# Altium project ST1-1.PrjPcb (part 5 of 5)

## Sheet HV_Detection.SchDoc: Output Terminals & Voltage detection
size A3; DocumentNumber: 9; SheetNumber: 12; SheetTotal: 20
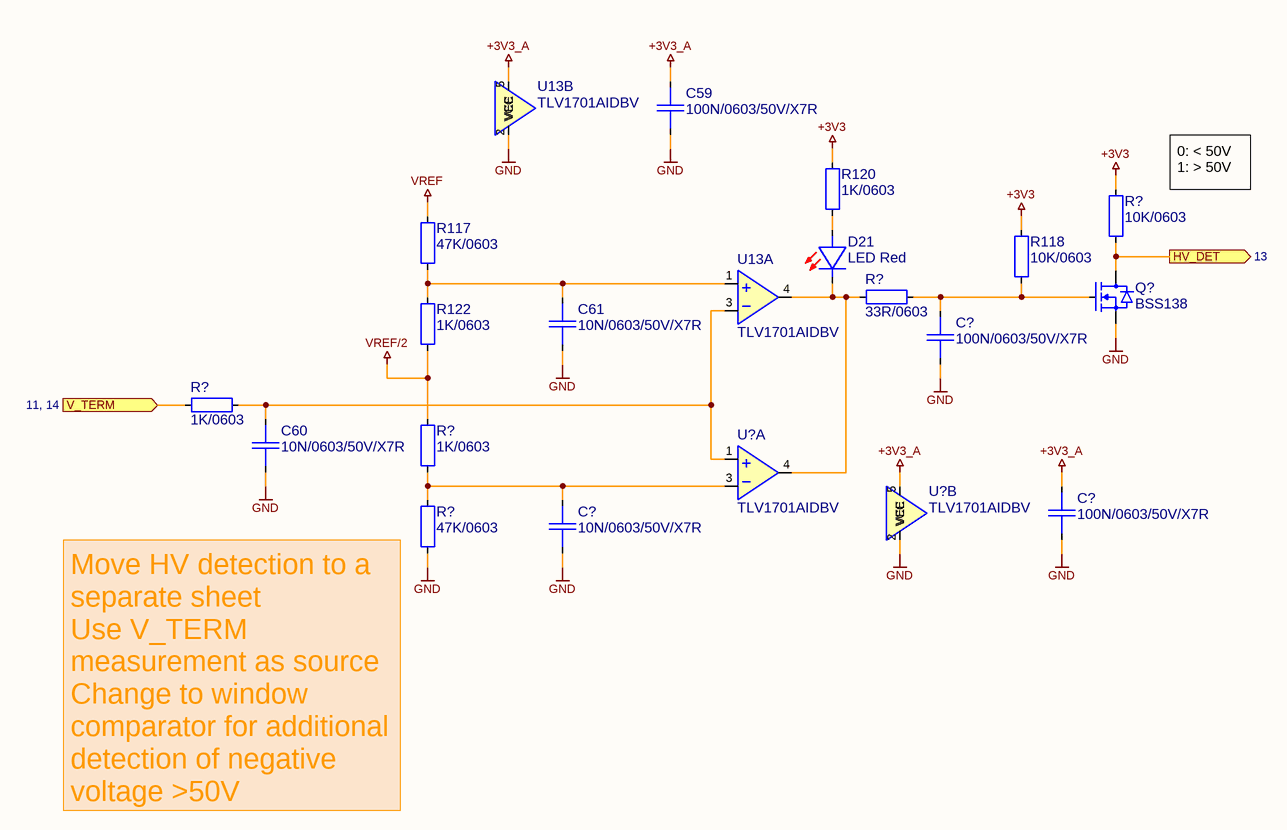
[diagram p12: HV_Detection.SchDoc]

### Parts
(Parts that share a designator on the sheet are numbered #1, #2 ... from top to bottom, then left to right.)
C59  100N/0603/50V/X7R  [CAP0603_X7R]
C60  10N/0603/50V/X7R  [CAP0603_X7R]
C61  10N/0603/50V/X7R  [CAP0603_X7R]
C?#3  100N/0603/50V/X7R  [CAP0603_X7R]
C?#4  100N/0603/50V/X7R  [CAP0603_X7R]
C?#5  10N/0603/50V/X7R  [CAP0603_X7R]
D21  LED Red  [LED0805_RED]
Q?#2  BSS138  [SOT2395P280X125-3-SE]
R117  47K/0603  [R0603-0.40-WW]
R118  10K/0603  [R0603-0.40-WW]
R120  1K/0603  [R0603-0.40-WW]
R122  1K/0603  [R0603-0.40-WW]
R?#32  10K/0603  [R0603-0.40-WW]
R?#33  33R/0603  [R0603-0.40-WW]
R?#34  1K/0603  [R0603-0.40-WW]
R?#35  1K/0603  [R0603-0.40-WW]
R?#36  47K/0603  [R0603-0.40-WW]
U13  TLV1701AIDBV  [SOT2395P280X125-5-NW]  (parts A,B of 2)
U?#3  TLV1701AIDBV  [SOT2395P280X125-5-NW]  (part A of 2)
U?#4  TLV1701AIDBV  [SOT2395P280X125-5-NW]  (part B of 2)

### Ports
HV_DET (out, see 13), V_TERM (in, see 11, 14)

### Nets
+3V3: R118.1 R120.2 R?#32.1
+3V3_A: C59.1 C?#4.1 U13.5(VCC) U?#4.5(VCC)
GND: C59.2 C60.2 C61.2 C?#3.2 C?#4.2 C?#5.2 Q?#2.2(SOURCE) R?#36.2 U13.2(VEE) U?#4.2(VEE)
VREF: R117.1
VREF/2: R122.2 R?#35.1
HV_DET: Q?#2.3(DRAIN) R?#32.2 ; port HV_DET
V_TERM: R?#34.1 ; port V_TERM
NetC60_1: C60.1 R?#34.2 U13.3(IN-) U?#3.1(IN+)
NetC61_1: C61.1 R117.2 R122.1 U13.1(IN+)
NetC?#3_1: C?#3.1 Q?#2.1(GATE) R118.2 R?#33.2
NetC?#5_1: C?#5.1 R?#35.2 R?#36.1 U?#3.3(IN-)
NetD21_1: D21.1(C) R?#33.1 U13.4(OUT) U?#3.4(OUT)
NetD21_2: D21.2(A) R120.1

### Notes on the sheet
- 0: < 50V
  1: > 50V
- (near R?#36) Move HV detection to a separate sheet
  Use V_TERM measurement as source
  Change to window comparator for additional detection of negative voltage >50V
- Date:
- Size:
- A3
- Schema:
- Layout:

### Library data of the parts
C59 C?#3 C?#4 = 100N/0603/50V/X7R: CAP SM 0603 100nF 50V X7R; Manufacturer: GENERIC; Manufacturer 1: YAGEO; Manufacturer Part Number 1: CC0603KPX7R9BB104; Absolute Value: 1E-7; Eurocircuits GPN: GPC0603104; Part Number: 100N/0603/50V/X7R; Package: 0603; Value: 100nF; HelpURL: https://www.yageo.com/upload/media/product/app/datasheet/mlcc/upy-gphc_x7r_6_3v-to-250v.pdf; Supplier 1: Digi-Key; Supplier Part Number 1: 311-3567-1-ND; Supplier 3: LCSC; Supplier Part Number 3: C14663; Manufacturer 2: YAGEO; Manufacturer Part Number 2: CC0603MRX7R9BB104; Supplier 2: Digi-Key; Supplier Part Number 2: 311-4110-1-ND; JLC Type: Basic; Manufacturer Part Number 3: CC0603KRX7R9BB104
C60 C61 C?#5 = 10N/0603/50V/X7R: CAP SM 0603 10nF 50V X7R; Manufacturer: GENERIC; Manufacturer 1: YAGEO; Manufacturer Part Number 1: CC0603KPX7R9BB103; Absolute Value: 1E-8; Eurocircuits GPN: GPC0603103; Part Number: 10N/0603/50V/X7R; Package: 0603; Value: 10nF; HelpURL: https://www.yageo.com/upload/media/product/app/datasheet/mlcc/upy-gphc_x7r_6_3v-to-250v.pdf; Supplier 1: Digi-Key; Supplier Part Number 1: 311-1572-1-ND; Manufacturer 2: YAGEO; Manufacturer Part Number 2: CC0603KRX7R9BB103; Supplier 2: Digi-Key; Supplier Part Number 2: 311-1085-1-ND; Manufacturer Part Number 3: CC0603KRX7R9BB103; Supplier 3: LCSC; Supplier Part Number 3: C100042
D21 = LED Red 0805: Generic LED Red 0805; Manufacturer 1: Würth; Manufacturer Part Number 1: 150080RS75000; Part Number: LED Red 0805; Manufacturer: GENERIC; Package: 805; Value: Red; Absolute Value: Red; HelpURL: https://www.we-online.com/katalog/datasheet/150060RS75000.pdf; Supplier 1: Digikey; Supplier Part Number 1: 732-4984-1-ND; Manufacturer 3: Foshan NationStar Optoelectronics; Manufacturer Part Number 3: NCD0805R1; Supplier 3: LCSC; Supplier Part Number 3: C84256; JLC Type: Basic
Q?#2 = BSS138: N-Kanal 50 V 220mA (Ta) 350mW (Ta) Oberflächenmontage SOT-23; Manufacturer: GENERIC; Manufacturer 1: ANBON SEMICONDUCTOR (INT'L) LIMITED; Part Number: BSS138; Package: SOT23; HelpURL: https://mm.digikey.com/Volume0/opasdata/d220001/medias/docus/3037/BSS138.pdf; Manufacturer Part Number 1: BSS138; Supplier 1: Digi-Key; Supplier Part Number 1: 4530-BSS138CT-ND; Manufacturer 3: FOSAN; Manufacturer Part Number 3: BSS138; Supplier 3: LCSC; Supplier Part Number 3: C2926186; JLC Type: Extended; Manufacturer 2: FOSAN; Manufacturer Part Number 2: BSS138; Supplier 2: LCSC; Supplier Part Number 2: C2926186
R117 R?#36 = 47K/0603: RES SM 0603 47K; Manufacturer: GENERIC; Manufacturer 1: YAGEO; Manufacturer Part Number 1: RC0603FR-1347KL; Absolute Value: 47000; Eurocircuits GPN: GPR060347K; Part Number: 47K/0603; Package: 0603; Value: 47K; HelpURL: https://www.yageogroup.com/content/datasheet/asset/file/PYU-RC_GROUP_51_ROHS_L; Supplier 1: Digi-Key; Supplier Part Number 1: 13-RC0603FR-1347KLCT-ND; Manufacturer 2: YAGEO; Manufacturer Part Number 2: RC0603FR-1047KL; Supplier 2: Digi-Key; Supplier Part Number 2: 13-RC0603FR-1047KLCT-ND; Manufacturer 3: UNI-ROYAL(Uniroyal Elec); Manufacturer Part Number 3: 0603WAF4702T5E; Supplier 3: LCSC; Supplier Part Number 3: C25819; JLC Type: Basic
R118 R?#32 = 10K/0603: RES SM 0603 10K; Manufacturer: GENERIC; Manufacturer 1: YAGEO; Manufacturer Part Number 1: RC0603FR-1310KL; Absolute Value: 10000; Eurocircuits GPN: GPR060310K; Part Number: 10K/0603; Package: 0603; Value: 10K; HelpURL: https://www.yageogroup.com/content/datasheet/asset/file/PYU-RC_GROUP_51_ROHS_L; Supplier 1: Digi-Key; Supplier Part Number 1: 13-RC0603FR-1310KLCT-ND; Manufacturer 2: YAGEO; Manufacturer Part Number 2: RC0603FR-1010KL; Supplier 2: Digi-Key; Supplier Part Number 2: 13-RC0603FR-1010KLCT-ND; Manufacturer 3: UNI-ROYAL(Uniroyal Elec); Manufacturer Part Number 3: 0603WAF1002T5E; Supplier 3: LCSC; Supplier Part Number 3: C25804; JLC Type: Basic
R120 R122 R?#34 R?#35 = 1K/0603: RES SM 0603 1K; Manufacturer: GENERIC; Manufacturer 1: YAGEO; Manufacturer Part Number 1: RC0603FR-131KL; Absolute Value: 1000; Eurocircuits GPN: GPR06031K; Part Number: 1K/0603; Package: 0603; Value: 1K; HelpURL: https://www.yageogroup.com/content/datasheet/asset/file/PYU-RC_GROUP_51_ROHS_L; Supplier 1: Digi-Key; Supplier Part Number 1: 13-RC0603FR-131KLCT-ND; Manufacturer 2: YAGEO; Manufacturer Part Number 2: RC0603FR-101KL; Supplier 2: Digi-Key; Supplier Part Number 2: 13-RC0603FR-101KLCT-ND; Manufacturer 3: UNI-ROYAL(Uniroyal Elec); Manufacturer Part Number 3: 0603WAF1001T5E; Supplier 3: LCSC; Supplier Part Number 3: C21190; JLC Type: Basic
R?#33 = 33R/0603: RES SM 0603 33R; Manufacturer: GENERIC; Manufacturer 1: YAGEO; Manufacturer Part Number 1: RC0603FR-1333RL; Absolute Value: 33; Eurocircuits GPN: GPR060333R; Part Number: 33R/0603; Package: 0603; Value: 33R; HelpURL: https://www.yageogroup.com/content/datasheet/asset/file/PYU-RC_GROUP_51_ROHS_L; Supplier 1: Digi-Key; Supplier Part Number 1: 13-RC0603FR-1333RLCT-ND; Manufacturer 2: YAGEO; Manufacturer Part Number 2: RC0603FR-1033RL; Supplier 2: Digi-Key; Supplier Part Number 2: 13-RC0603FR-1033RLCT-ND
U13 U?#3 U?#4 = TLV1701 SOT23: TLV1701 2.2-V to 36-V, microPower Comparato; Manufacturer: Texas Instruments; Manufacturer Part Number 1: TLV1701AIDBVR; Part Number: TLV1701 SOT23; Package: SOT23-5; HelpURL: https://www.ti.com/lit/ds/symlink/tlv1701.pdf; Manufacturer 1: Texas Instruments; Supplier 1: Digi-Key; Supplier Part Number 1: 296-40599-1-ND; Manufacturer 2: Texas Instruments; Manufacturer Part Number 2: TLV1701QDBVRQ1; Supplier 2: Digi-Key; Supplier Part Number 2: 296-47458-1-ND; Manufacturer 3: Texas Instruments; Manufacturer Part Number 3: TLV1701AIDBVR; Supplier 3: LCSC; Supplier Part Number 3: C130035

## Sheet Iso_Current_Limit.SchDoc: Current Limiter
size A3; DocumentNumber: 6; SheetNumber: 6; SheetTotal: 19
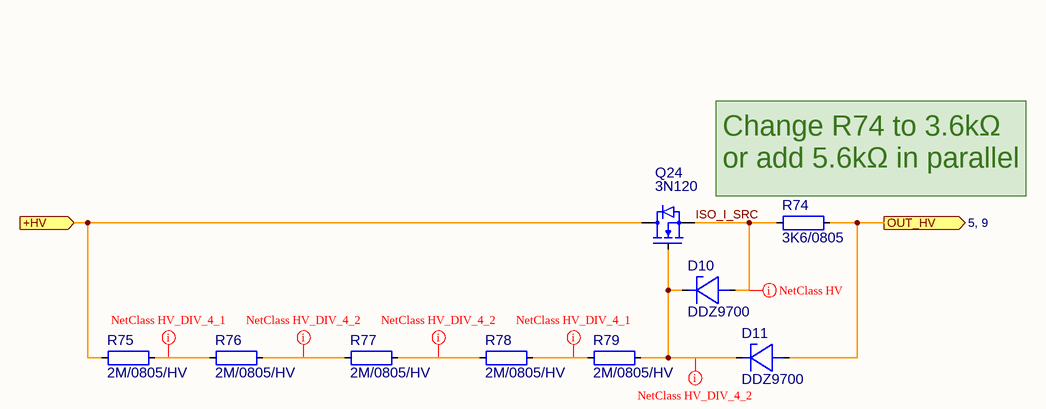
[diagram p13: Iso_Current_Limit.SchDoc]

### Parts
D10  DDZ9700  [SOD3718X125]
D11  DDZ9700  [SOD3718X125]
Q24  3N120  [TO228P990X229-3]
R74  3K6/0805  [R0805-0.50-WW]
R75  2M/0805/HV  [R0805-0.50-HV-WW]
R76  2M/0805/HV  [R0805-0.50-HV-WW]
R77  2M/0805/HV  [R0805-0.50-HV-WW]
R78  2M/0805/HV  [R0805-0.50-HV-WW]
R79  2M/0805/HV  [R0805-0.50-HV-WW]

### Ports
+HV (in), OUT_HV (out, see 5, 9)

### Nets
ISO_I_SRC: D10.2(A) Q24.2(SOURCE) R74.1
NetD10_1: D10.1(C) D11.1(C) Q24.1(GATE) R79.2
NetD11_2: D11.2(A) R74.2 ; port OUT_HV
NetQ24_3: Q24.3(DRAIN) R75.2 ; port +HV
NetR75_1: R75.1 R76.2
NetR76_1: R76.1 R77.2
NetR77_1: R77.1 R78.2
NetR78_1: R78.1 R79.1

### Layout directives
net class HV_DIV_4_1: NetR75_1, NetR78_1
net class HV_DIV_4_2: NetD10_1, NetR76_1, NetR77_1
net class HV: ISO_I_SRC

### Notes on the sheet
- TO-220 option: IXTP3N120
- (near Q24) Alternative:
  CMD3N120 (C49208270)
- Change R74 to 3.6kΩ
  or add 5.6kΩ in parallel
- Date:
- Size:
- A3
- Schema:
- Layout:

### Library data of the parts
D10 D11 = DDZ9700: Low current zener diode 13V 500mW SOD123; Manufacturer: Diodes Incorporated; Manufacturer Part Number 1: DDZ9700-7; Part Number: DDZ9700; Package: SOD-123; Value: 13V; Absolute Value: 13V; HelpURL: https://www.diodes.com/datasheet/download/DDZ96xx-DDZ97xx.pdf; Manufacturer 1: Diodes Incorporated; Supplier 1: Digikey; Supplier Part Number 1: 31-DDZ9700-7CT-ND; Manufacturer 3: DIODES; Manufacturer Part Number 3: DDZ9700-7; Supplier 3: LCSC; Supplier Part Number 3: C460862; JLC Type: Extended
Q24 = 3N120: N-Channel MOSFET 1200V; Manufacturer: Tech Public; Part Number: 3N120; Package: TO-252AA; HelpURL: https://www.lcsc.com/datasheet/C42437012.pdf; Manufacturer 3: TECH PUBLIC; Manufacturer Part Number 3: 3N120; Supplier 3: LCSC; Supplier Part Number 3: C42437012; JLC Type: Extended
R74 = 3K6/0805: RES SM 0805 3K6; Manufacturer: GENERIC; Manufacturer 1: YAGEO; Manufacturer Part Number 1: RC0805FR-133K6L; Absolute Value: 3600; Eurocircuits GPN: GPR08053K6; Part Number: 3K6/0805; Package: 0805; Value: 3K6; HelpURL: https://www.yageogroup.com/content/datasheet/asset/file/PYU-RC_GROUP_51_ROHS_L; Supplier 1: Digi-Key; Supplier Part Number 1: 13-RC0805FR-133K6LCT-ND; Manufacturer 2: YAGEO; Manufacturer Part Number 2: RC0805FR-073K6L; Supplier 2: Digi-Key; Supplier Part Number 2: 311-3.60KCRCT-ND
R75-R79 = 2M/0805/HV: RES SM 0805 2M High voltage; Manufacturer: GENERIC; Manufacturer 1: YAGEO; Manufacturer Part Number 1: RV0805FR-072ML; Absolute Value: 2000000; Part Number: 2M/0805/HV; Package: 0805; Value: 2M; HelpURL: https://www.yageogroup.com/content/datasheet/asset/file/PYU-RV_51_ROHS_L; Supplier 1: Digi-Key; Supplier Part Number 1: 13-RV0805FR-072MLCT-ND; JLC Type: Extended; Manufacturer 3: YAGEO; Manufacturer Part Number 3: RV0805FR-072ML; Supplier 3: LCSC; Supplier Part Number 3: C873372

## Nets that join several sheets
+3V3: ST1-1-Top (TP2.1), Microcontroller (11 pins), User_Interface (8 pins), Converter (C41.1 U6.14), Current_Controller (R149.1), Measurement (10 pins), Overvoltage_Protection (C54.1 D15.2 U9.5), Peripherals (17 pins), HV_Detection (R118.1 R120.2 R?#32.1)
+3V3_A: ST1-1-Top (TP10.1), Microcontroller (C102.1 U21.37), Battery_BMS (C13.1 U2.6), Converter (C?#1.1 U?#1.5), Current_Controller (Q32.2), Measurement (14 pins), Overvoltage_Protection (8 pins), Overcurrent_Protection (9 pins), HV_Detection (C59.1 C?#4.1 U13.5 U?#4.5)
+3V3_STBY: Microcontroller (D52.1), Battery_BMS (C6.1 U1.15), User_Interface (D34.2)
+5V: ST1-1-Top (TP4.1), Converter (C37.1 C38.1 U4.14 U5.14), Measurement (R?#12.2)
+15V: ST1-1-Top (TP1.1), User_Interface (R206.2), Converter (R57.1), Output_Terminals (7 pins), Current_Controller (7 pins), Measurement (R?#11.2)
GND: ST1-1-Top (TP6.1 TP7.1 TP8.1 TP9.1), Microcontroller (20 pins), Battery_BMS (8 pins), User_Interface (32 pins), Converter (22 pins), On_Off (15 pins), Output_Terminals (6 pins), Current_Controller (13 pins), Measurement (25 pins), Overvoltage_Protection (10 pins), Peripherals (31 pins), Overcurrent_Protection (7 pins), HV_Detection (10 pins)
GND_PWR: ST1-1-Top (TP5.1), Battery_BMS (NT1.2), Converter (22 pins), Output_Terminals (R129.2 R130.1), Overvoltage_Protection (C52.2 R89.2 R92.2 R94.2)
VBAT_STBY: Battery_BMS (Q1.3), On_Off (Q9.2 R30.1)
VREF: Converter (R51.1 R52.1 R53.1), Current_Controller (R131.1 R150.1), Peripherals (R236.1 U22.1 U22.4), HV_Detection (R117.1)
VREF/2: Battery_BMS (U2.5), Current_Controller (R146.2), Measurement (16 pins), Peripherals (U23.1 U23.4), HV_Detection (R122.2 R?#35.1)
ADC.CLK: Microcontroller (U21.73), Measurement (U18.17)
ADC.~{DRDY}: Microcontroller (U21.84), Measurement (U18.13)
ADC.~{SYNC}/~{RESET}: Microcontroller (U21.82), Measurement (U18.11)
BMS_CTRL.I_BAT: Microcontroller (U21.69), Battery_BMS (U2.1)
BMS_CTRL.WAKEUP: Microcontroller (U21.10), Battery_BMS (R21.2)
BMS_ON_OFF.CHG: Battery_BMS (U1.10), On_Off (Q17.1)
BMS_ON_OFF.DSG: Battery_BMS (Q2.1 R12.1 U1.9), User_Interface (Q36.1), On_Off (Q16.1)
BOOT0: Microcontroller (R233.1 U21.95), Peripherals (J7.9)
BUTTON.ESC: Microcontroller (U21.86), User_Interface (Q38.3 R223.2)
BUTTON.OK: Microcontroller (U21.98), User_Interface (Q37.3 R222.2)
BUTTON.OUT: Microcontroller (U21.96), User_Interface (Q39.3 R224.2)
CONV_CTRL.EN: Microcontroller (U21.38), Converter (R47.1 R50.1 U6.2 U6.5)
CONV_CTRL.PRIM_H: Microcontroller (U21.72), Converter (U6.10)
CONV_CTRL.PRIM_L: Microcontroller (U21.71), Converter (U6.13)
CONV_CTRL.SEC_H: Microcontroller (U21.68), Converter (U6.4)
CONV_CTRL.SEC_L: Microcontroller (U21.67), Converter (U6.1)
CONV_CTRL.TEMP_PRIM: Microcontroller (U21.56), Converter (C44.1 R53.2 R56.1)
CONV_CTRL.TEMP_SEC: Microcontroller (U21.57), Converter (C43.1 R52.2 R55.1)
CONV_CTRL.TEMP_TRAFO: Microcontroller (U21.59), Converter (C42.1 R51.2 R54.1)
DISCHARGE/: Microcontroller (U21.31), Converter (Q19.1 R58.1)
DISPLAY.CS: Microcontroller (U21.3), User_Interface (D40.1 R213.2)
DISPLAY.MISO: Microcontroller (U21.4), User_Interface (D37.1 R210.2)
DISPLAY.MOSI: Microcontroller (U21.5), User_Interface (D38.1 R211.2)
DISPLAY.SCK: Microcontroller (U21.1), User_Interface (D39.1 R212.2)
DISPLAY.WR: Microcontroller (U21.2), User_Interface (D41.1 R215.2)
ENCODER.A: Microcontroller (U21.94), User_Interface (C86.1 D45.1 R221.2)
ENCODER.B: Microcontroller (U21.93), User_Interface (C85.1 D44.1 R218.2)
HV_DET: User_Interface (R219.1), HV_Detection (Q?#2.3 R?#32.2)
I2C.ALERT: Microcontroller (U21.62), Battery_BMS (U1.14), Peripherals (R241.2 U26.13)
I2C.SCL: Microcontroller (U21.65), Battery_BMS (U1.12), User_Interface (D35.1 R207.1), Peripherals (R239.2 U25.6 U26.14)
I2C.SDA: Microcontroller (U21.66), Battery_BMS (U1.13), User_Interface (D36.1 R209.1), Peripherals (R240.2 U25.5 U26.15)
I_1A_REF: Microcontroller (U21.27), Current_Controller (R153.1)
I_ISO: Microcontroller (U21.70), Measurement (R198.2 U20.1), Overcurrent_Protection (U11.3)
I_ISO_N: Output_Terminals (C62.2 R127.2), Measurement (D33.3 U20.4)
I_ISO_P: Output_Terminals (C62.1 R125.2), Measurement (D32.3 U20.3)
I_OUT: Microcontroller (U21.20), Current_Controller (U14.5), Measurement (R175.2 U17.1)
I_OUT_N: Output_Terminals (C63.2 R130.2), Measurement (D29.3 U16.4)
I_OUT_P: Output_Terminals (C63.1 R128.2), Measurement (D28.3 U16.3)
NetK?#2_4: Output_Terminals (K?#2.4 R?#9.1), Current_Controller (Q31.3 R133.2 R137.2)
NetQ31_2: Output_Terminals (R126.2 R127.1 R128.1 R129.1), Current_Controller (Q31.2)
OCP/: Microcontroller (U21.30), Overcurrent_Protection (R100.1 R101.1 R104.2 U10.4)
ON_REQ: Microcontroller (U21.40), On_Off (Q15.1 R46.1)
OUT_HV: ST1-1-Top (TP13.1), Output_Terminals (K2.6 K2.8)
OUT_LV: ST1-1-Top (TP12.1), Converter (18 pins), Output_Terminals (K1.4 R107.2), Overvoltage_Protection (D13.1 D14.2)
OUT_SEL_HV: Microcontroller (U21.16), Output_Terminals (Q27.1 R114.1)
OUT_SEL_ISO: Microcontroller (U21.45), Output_Terminals (Q28.1 R124.1)
OVP/: Microcontroller (U21.18), Converter (D8.1), Overvoltage_Protection (5 pins)
OVP_RESET: Microcontroller (U21.17), Overvoltage_Protection (Q26.1 R83.1)
QSPI.CLK: Microcontroller (U21.25), Peripherals (U24.6)
QSPI.CS/: Microcontroller (U21.22), Peripherals (R?#31.2 U24.1)
QSPI.IO0: Microcontroller (U21.33), Peripherals (U24.5)
QSPI.IO1: Microcontroller (U21.32), Peripherals (U24.2)
QSPI.IO2: Microcontroller (U21.29), Peripherals (R?#29.2 U24.3)
QSPI.IO3: Microcontroller (U21.28), Peripherals (R?#30.2 U24.7)
RESET/: Microcontroller (R234.2 U21.14), Peripherals (J7.10 SW1.1)
SENS_N: Output_Terminals (J5.1), Measurement (R191.1 R?#21.1)
SENS_P: Output_Terminals (J4.1), Measurement (R178.1 R?#15.1)
SHUNT_EN: Microcontroller (U21.15), Current_Controller (Q33.1 R149.2)
SHUNT_ISO_EN: Microcontroller (U21.60), Current_Controller (Q30.1 R139.1)
SPI.CS: Microcontroller (U21.78), Measurement (U18.12)
SPI.MISO: Microcontroller (U21.80), Measurement (U18.15)
SPI.MOSI: Microcontroller (U21.81), Measurement (U18.16)
SPI.SCK: Microcontroller (U21.79), Measurement (U18.14)
SWD.SWCLK: Microcontroller (U21.77), Peripherals (J7.4)
SWD.SWDAT: Microcontroller (U21.76), Peripherals (J7.2)
SWD.SWO: Microcontroller (U21.90), Peripherals (J7.6)
TEMP_CURRENT: Microcontroller (U21.55), Current_Controller (C69.1 R150.2 R152.1)
TERM_N: Output_Terminals (GDT1.2 J3.1 K?#2.3), Measurement (R164.1)
TERM_P: Output_Terminals (F2.2 J2.1), Measurement (R154.1)
UART.RX: Microcontroller (U21.88), User_Interface (D43.1 R216.1), Peripherals (J7.7)
UART.TX: Microcontroller (U21.87), User_Interface (D42.1 R214.1), Peripherals (J7.8)
UI_ON_OFF.OFF: User_Interface (R228.2), On_Off (Q13.1)
UI_ON_OFF.ON: User_Interface (D46.1 D47.1 D48.1 R229.1), On_Off (Q14.1 R45.1)
UI_PRESENT: Microcontroller (U21.92), User_Interface (Q35.3 R205.1)
V_IN: Microcontroller (U21.44), On_Off (C15.1 R29.2 R34.1)
V_LV: Microcontroller (U21.46), Converter (U?#2.1 U?#2.4)
V_TERM: Microcontroller (U21.21), Measurement (R160.1 U15.6), HV_Detection (R?#34.1)
VBAT: Battery_BMS (8 pins), On_Off (11 pins)
VIN: ST1-1-Top (TP11.1), Converter (5 pins), On_Off (D6.1 Q6.1,2,3 R29.1 R31.1)
VREF/2_UC: Microcontroller (U21.26), Peripherals (R237.1)
VREF_UC: Microcontroller (U21.36), Peripherals (U22.3)

## Assembly variants
ST1-1: not fitted C95 C96 C128 C138 C145 D35 D36 L1 R48 R49 R107 R236 R238 Y2
ST1-10: not fitted C45 C46 C47 C48 C49 C50 C55 C56 C57 C62 C64 C65 C66 C67 C68 C69 C70 C78 C80 C81 C83 C84 C95 C96 C128 C138 C145 D9 D10 D11 D17 D18 D20 D22 D23 D24 D25 D30 D31 D32 D33 D35 D36 J4 J5 K1 K2 L1 L3 Q21 Q22 Q23 Q24 Q27 Q28 Q29 Q30 Q31 Q32 Q33 R48 R49 R60 R61 R62 R63 R64 R65 R66 R67 R68 R69 R70 R71 R72 R73 R74 R75 R76 R77 R78 R79 R97 R98 R99 R100 R101 R102 R103 R104 R105 R106 R111 R114 R123 R124 R125 R127 R131 R132 R133 R134 R136 R137 R138 R139 R140 R141 R142 R143 R144 R145 R146 R147 R148 R149 R150 R151 R152 R153 R178 R179 R180 R181 R182 R183 R184 R185 R186 R187 R188 R189 R190 R191 R192 R193 R194 R195 R196 R198 R199 R236 R238 U7 U10 U11 U14 U19 U20 Y2; alternate parts U18 -> ADS131M02 TSSOP, R126 -> 0R/1206